# EAGLE design box-din3-lcd (EAGLE 5.11)
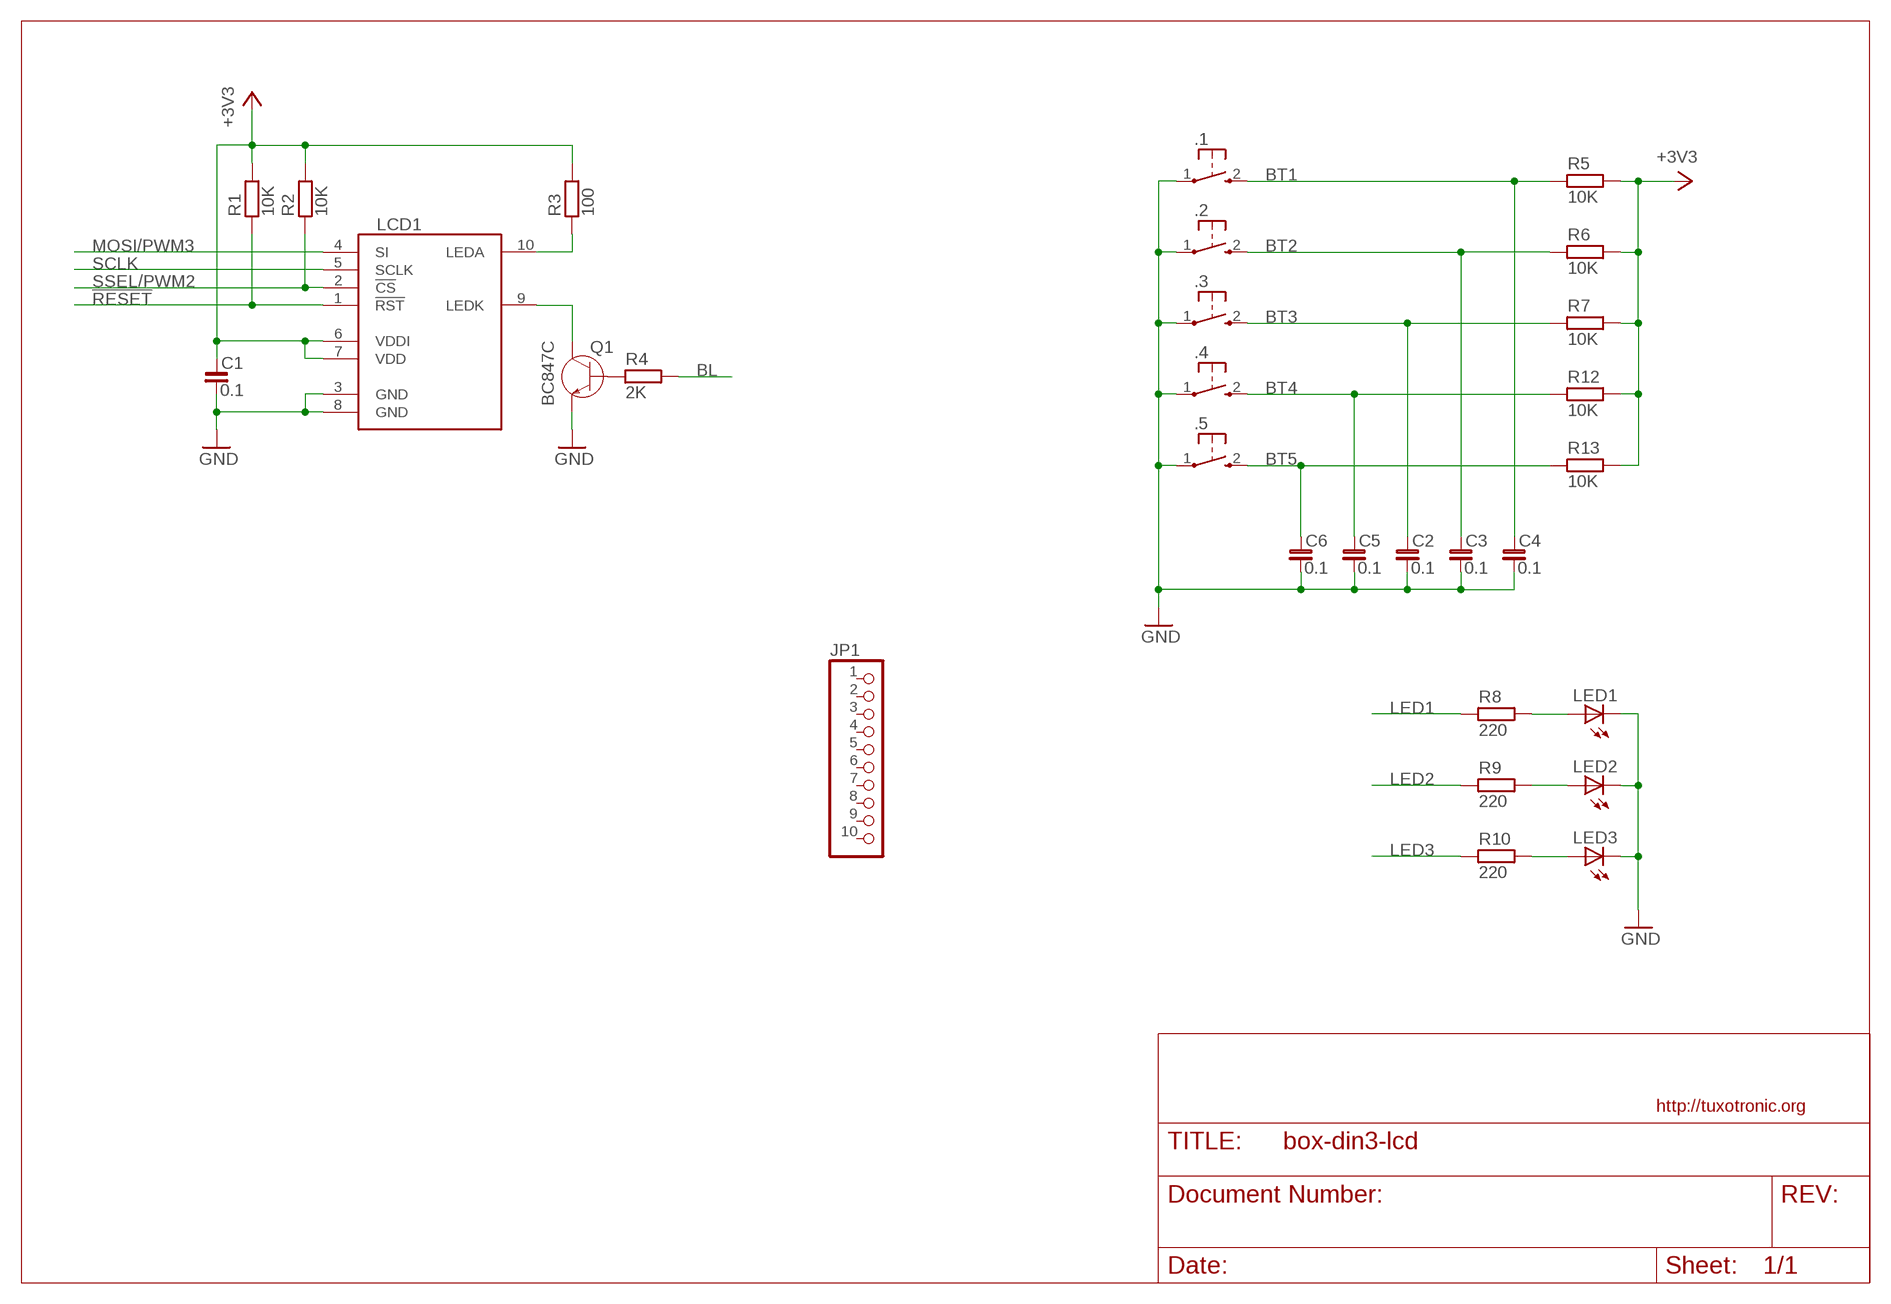
[diagram p0: schematic, sheet 1]

## Parts
.1  KSS-2EG4430  [KSS-2EG4430]
.2  KSS-2EG4430  [KSS-2EG4430]
.3  KSS-2EG4430  [KSS-2EG4430]
.4  KSS-2EG4430  [KSS-2EG4430]
.5  KSS-2EG4430  [KSS-2EG4430]
C1  0.1  C_0603  [C0603]
C2  0.1  C_0603  [C0603]
C3  0.1  C_0603  [C0603]
C4  0.1  C_0603  [C0603]
C5  0.1  C_0603  [C0603]
C6  0.1  C_0603  [C0603]
JP1  PINHD-1X10_2.00  [1X10M]
LCD1  LCD1202-EXT  [NOKIA1202LCD-EXT]
LED1  LEDCHIPLED_0805  [CHIPLED_0805]
LED2  LEDCHIPLED_0805  [CHIPLED_0805]
LED3  LEDCHIPLED_0805  [CHIPLED_0805]
Q1  BC847C  [SOT23]
R1  10K  R_0603  [R0603]
R2  10K  R_0603  [R0603]
R3  100  R_0805  [R0805]
R4  2K  R_0603  [R0603]
R5  10K  R_0603  [R0603]
R6  10K  R_0603  [R0603]
R7  10K  R_0603  [R0603]
R8  220  R_0603  [R0603]
R9  220  R_0603  [R0603]
R10  220  R_0603  [R0603]
R12  10K  R_0603  [R0603]
R13  10K  R_0603  [R0603]

## Nets
!RESET: LCD1.1(!RST) R1.1
+3V3: C1.1 LCD1.6(VDDI) LCD1.7(VDD) R1.2 R2.2 R3.2 R5.2 R6.2 R7.2 R12.2 R13.2
BL: R4.2
BT1: .1.2(S) C4.1 R5.1
BT2: .2.2(S) C3.1 R6.1
BT3: .3.2(S) C2.1 R7.1
BT4: .4.2(S) C5.1 R12.1
BT5: .5.2(S) C6.1 R13.1
GND: .1.1(P) .2.1(P) .3.1(P) .4.1(P) .5.1(P) C1.2 C2.2 C3.2 C4.2 C5.2 C6.2 LCD1.3(GND) LCD1.8(GND) LED1.C LED2.C LED3.C Q1.2(E)
LED1: R8.1
LED2: R9.1
LED3: R10.1
MOSI/PWM3: LCD1.4(SI)
N$1: LED1.A R8.2
N$2: LED2.A R9.2
N$3: LED3.A R10.2
N$7: LCD1.9(LEDK) Q1.3(C)
N$8: LCD1.10(LEDA) R3.1
N$9: Q1.1(B) R4.1
SCLK: LCD1.5(SCLK)
SSEL/PWM2: LCD1.2(!CS) R2.1
Unconnected: JP1.1 JP1.2 JP1.3 JP1.4 JP1.5 JP1.6 JP1.7 JP1.8 JP1.9 JP1.10

## Library data of the parts
.1-.5 = buttons:KSS-2EG4430: Size: 3x6mm Height: 5mm from PCB Rating: DC12v 50mA Travel: 0.25±0.10mm Operating Force: 180±50gf Return Force: 60gf min Contact resistance: 100m? max Insulation resistance: 100M? min Operating life?50,000 cycles
C1-C6 = rc-master-smd:C_: NON-POLARIZED CAP
JP1 = pinhead-fixdrills:PINHD-1X10: PIN HEADER
LCD1 = lcd1202:LCD1202: 1.3" b/w graphics display 96x68 pixel. From Nokia 1202 cell phone
LED1-LED3 = led:LED: LED OSRAM: - CHIPLED LG R971, LG N971, LY N971, LG Q971, LY Q971, LO R971, LY R971 LH N974, LH R974 LS Q976, LO Q976, LY Q976 LO Q996 - Hyper CHIPLED LW Q18S LB Q993, LB Q99A, LB R99A - SideLED LS A670, LO A670, LY A670, LG A670, LP A670 LB A673, LV A673, LT A673, LW A673 LH A674 LY A675 LS A676, LA A676, LO A676, LY A676, LW A676 LS A679, LY A679, LG A679 - Hyper Micro SIDELED® LS Y876, LA Y876, LO Y876, LY Y876 LT Y87S - SmartLED LW L88C, LW L88S LB L89C, LB L89S, LG L890 LS L89K, LO L89K, LY L89K LS L896, LA L896, LO L896, LY L896 - TOPLED LS T670, LO T670, LY T670, LG T670, LP T670 LSG T670, LSP T670, LSY T670, LOP T670, LYG T670 LG T671, LOG T671, LSG T671 LB T673, LV T673, LT T673, LW T673 LH T674 LS T676, LA T676, LO T676, LY T676, LB T676, LH T676, LSB T676, LW T676 LB T67C, LV T67C, LT T67C, LS T67K, LO T67K, LY T67K, LW E67C LS E67B, LA E67B, LO E67B, LY E67B, LB E67C, LV E67C, LT E67C LW T67C LS T679, LY T679, LG T679 LS T770, LO T770, LY T770, LG T770, LP T770 LB T773, LV T773, LT T773, LW T773 LH T774 LS E675, LA E675, LY E675, LS T675 LS T776, LA T776, LO T776, LY T776, LB T776 LHGB T686 LT T68C, LB T68C - Hyper Mini TOPLED® LB M676 - Mini TOPLED Santana® LG M470 LS M47K, LO M47K, LY M47K Source: http://www.osram.convergy.de - LUMILED® LXK2-PW12-R00, LXK2-PW12-S00, LXK2-PW14-U00, LXK2-PW14-V00 LXK2-PM12-R00, LXK2-PM12-S00, LXK2-PM14-U00 LXK2-PE12-Q00, LXK2-PE12-R00, LXK2-PE12-S00, LXK2-PE14-T00, LXK2-PE14-U00 LXK2-PB12-K00, LXK2-PB12-L00, LXK2-PB12-M00, LXK2-PB14-N00, LXK2-PB14-P00, LXK2-PB14-Q00 LXK2-PR12-L00, LXK2-PR12-M00, LXK2-PR14-Q00, LXK2-PR14-R00 LXK2-PD12-Q00, LXK2-PD12-R00, LXK2-PD12-S00 LXK2-PH12-R00, LXK2-PH12-S00 LXK2-PL12-P00, LXK2-PL12-Q00, LXK2-PL12-R00 Source: www.luxeon.com
Q1 = semiconductor:BC847: Bipolar transistor NPN-structure
R1-R10 R12 R13 = rc-master-smd:R_: RESISTOR

## Board
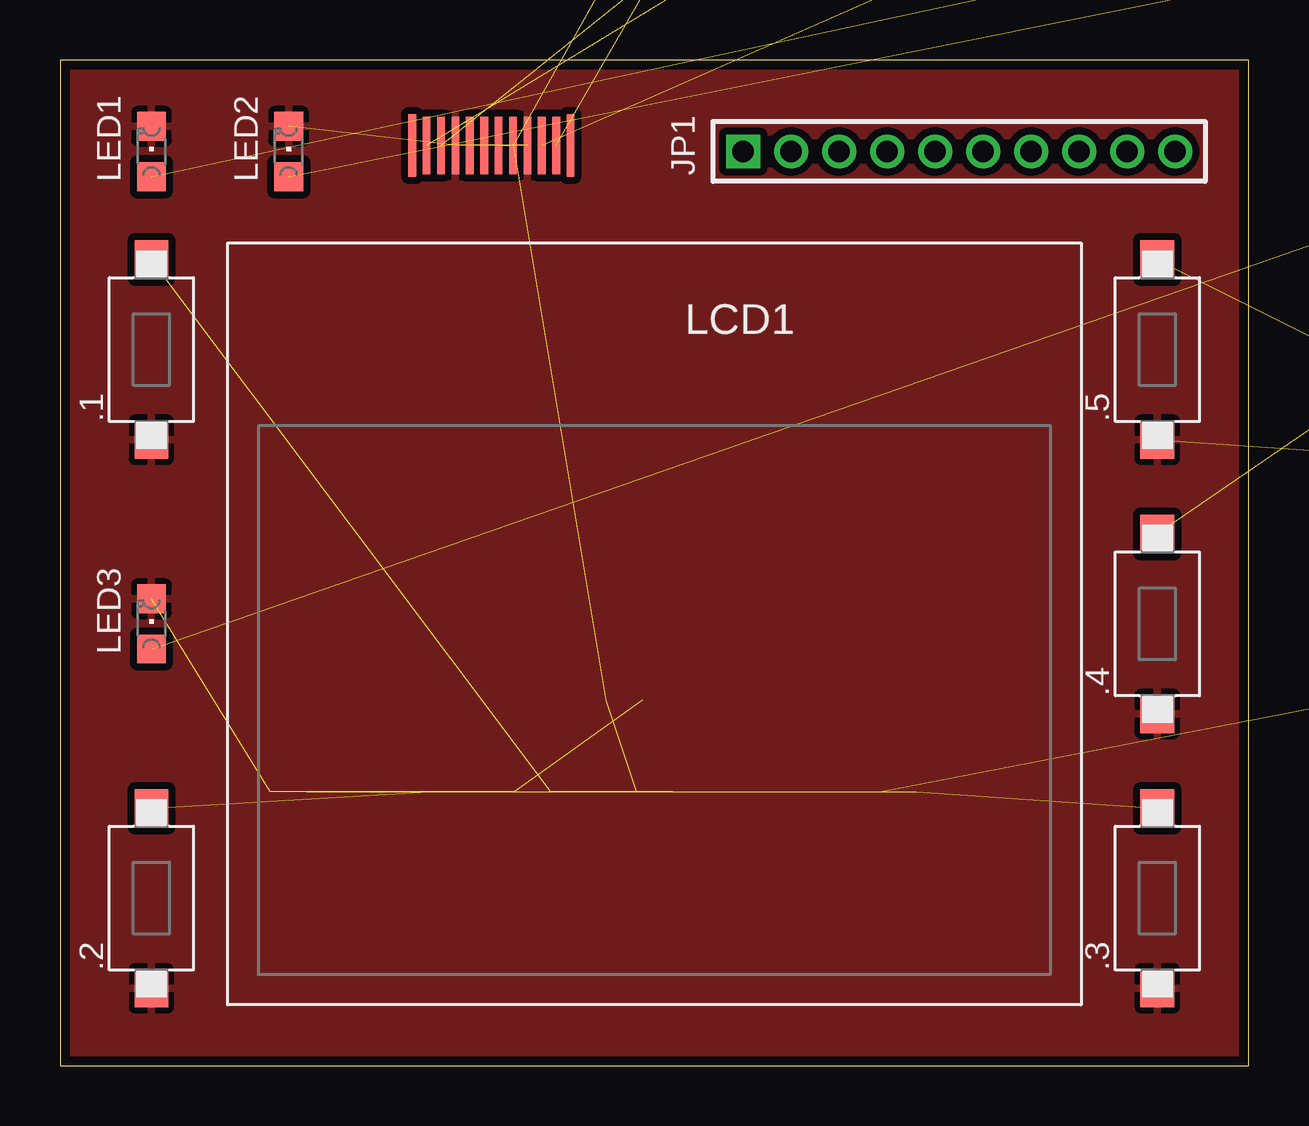
[diagram p1: board, top side]
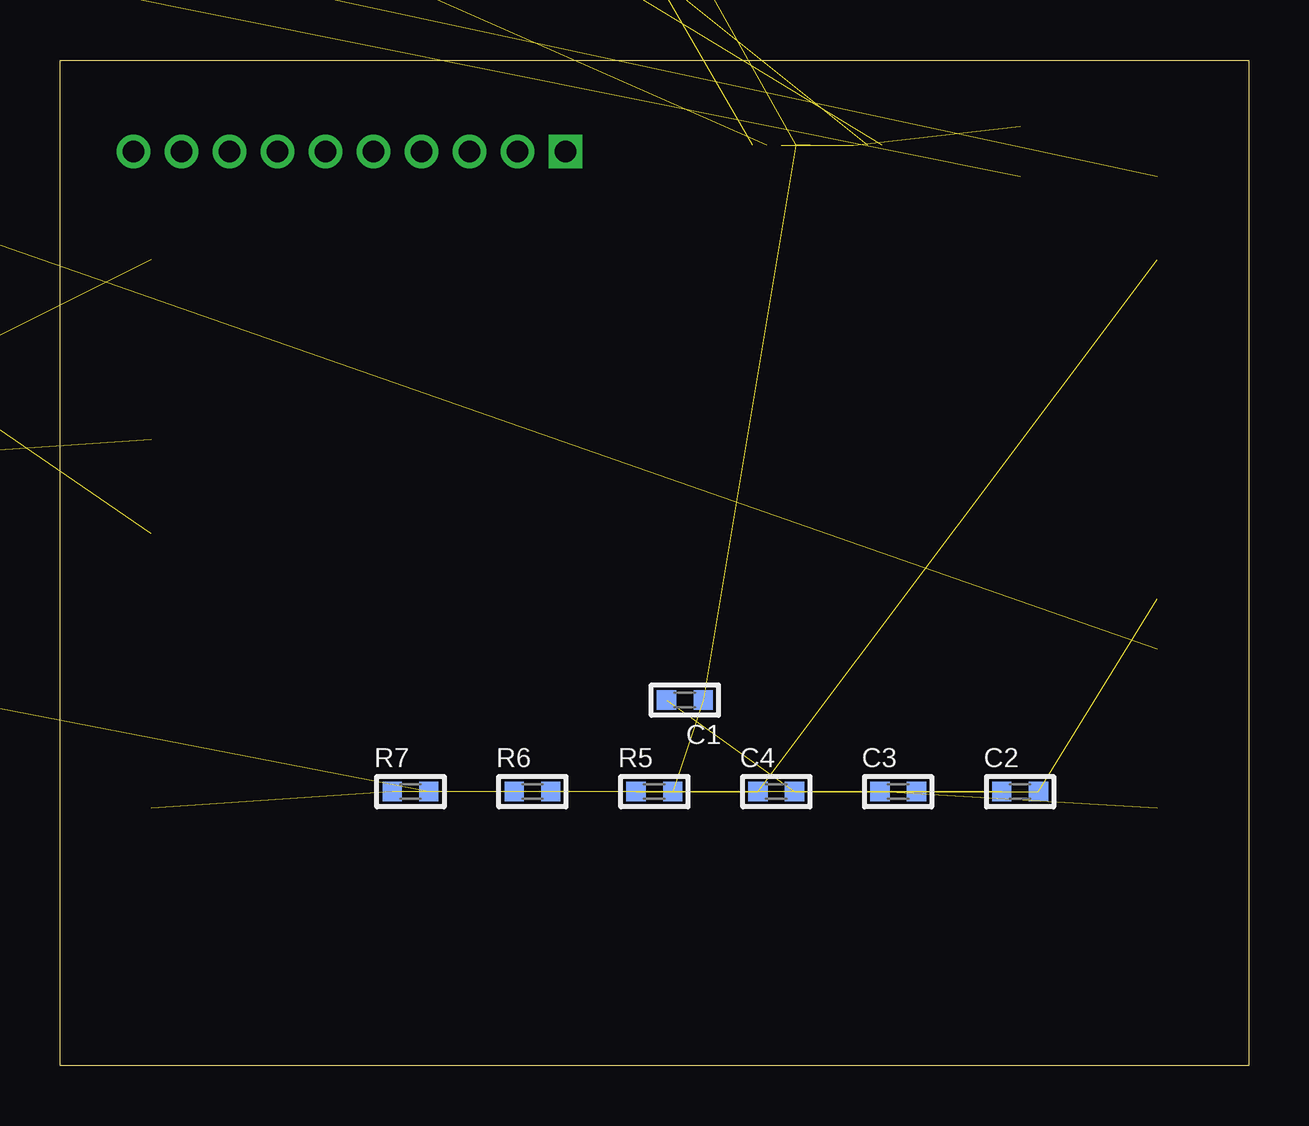
[diagram p2: board, bottom side, seen from below]

Size 49.53 x 41.91 mm. Coordinates in mm from the lower left corner, seen from the top.
Outline: 0,0 49.53,0 49.53,41.91 0,41.91 0,0
Copper layers (1*16): Top 0.035mm / dielectric 1.5mm / Bottom 0.035mm
Design rules "default *": minimum track width 10mil, minimum drill 24mil, track to track 8mil, track to pad 8mil, pad to pad 8mil, via to via 8mil, smd to smd 8mil, copper to edge 0.4mm, drill to drill 8mil, minimum pad ring 10mil, minimum via ring 8mil, stop-mask expansion 4mil, vias tented up to drill 0mil, thermal gap 10mil

### Footprints (pad centres in the part's own frame; a part is rotated, then mirrored left to right if it is on the bottom)
KSS-2EG4430 = smd 1.6 x 1.4: 1 -3.75,0; 2 3.75,0
C0603 = smd 0.8 x 0.8: 1 -0.762,0; 2 0.762,0
1X10M = drill 0.9 square: 1 -9,0 | drill 0.9 round: 2 -7,0; 3 -5,0; 4 -3,0; 5 -1,0; 6 1,0; 7 3,0; 8 5,0; 9 7,0; 10 9,0
NOKIA1202LCD-EXT = smd 0.32 x 2.6: 0 -10.09,23.114; 11 -3.49,23.114 | smd 0.32 x 2.4: 1 -9.49,23.114; 2 -8.89,23.114; 3 -8.29,23.114; 4 -7.69,23.114; 5 -7.09,23.114; 6 -6.49,23.114; 7 -5.89,23.114; 8 -5.29,23.114; 9 -4.69,23.114; 10 -4.09,23.114
CHIPLED_0805 = smd 1.2 x 1.2: A 0,-1.05; C 0,1.05
SOT23 = smd 1 x 1.4: 1 -0.95,-1.1; 2 0.95,-1.1; 3 0,1.1
R0603 = smd 0.8 x 0.8: 1 -0.762,0; 2 0.762,0
R0805 = smd 1.2 x 1.3: 1 -1.016,0; 2 1.016,0

### Placement (x,y rotation side)
.1  3.81,29.84 90 top
.2  3.81,6.99 90 top
.3  45.72,6.99 90 top
.4  45.72,18.41 90 top
.5  45.72,29.84 90 top
C1  23.5,15.24 180 bottom
C2  9.53,11.43 0 bottom
C3  14.61,11.43 0 bottom
C4  19.68,11.43 0 bottom
C5  64.14,35.56 90 top  (outside the outline)
C6  64.14,24.77 0 top  (outside the outline)
JP1  37.47,38.1 0 top
LCD1  24.77,15.24 0 top
LED1  3.81,38.1 0 top
LED2  9.53,38.1 0 top
LED3  3.81,18.41 0 top
Q1  55.88,55.24 180 top  (outside the outline)
R1  38.1,52.7 180 top  (outside the outline)
R2  33.02,52.7 180 top  (outside the outline)
R3  27.94,52.7 180 top  (outside the outline)
R4  58.42,60.33 180 top  (outside the outline)
R5  24.77,11.43 0 bottom
R6  29.84,11.43 0 bottom
R7  34.92,11.43 0 bottom
R8  59.69,48.9 0 bottom  (outside the outline)
R9  59.69,46.99 0 bottom  (outside the outline)
R10  55.24,35.56 180 bottom  (outside the outline)
R12  64.14,40.01 90 top  (outside the outline)
R13  59.69,16.51 0 top  (outside the outline)

### Tracks (layer width: path | path; a pad name or v marks a point on that pad's centre or on a via)
!RESET  (1 unrouted)
+3V3  (10 unrouted)
BT1  (2 unrouted)
BT2  (2 unrouted)
BT3  (2 unrouted)
BT4  (2 unrouted)
BT5  (2 unrouted)
GND  (9 unrouted)
  pour Top (isolate 0.305, rank 5): -0.64,42.55 50.16,42.55 50.16,-0.64 -0.64,-0.64
N$1  (1 unrouted)
N$2  (1 unrouted)
N$3  (1 unrouted)
N$7  (1 unrouted)
N$8  (1 unrouted)
N$9  (1 unrouted)
SSEL/PWM2  (1 unrouted)